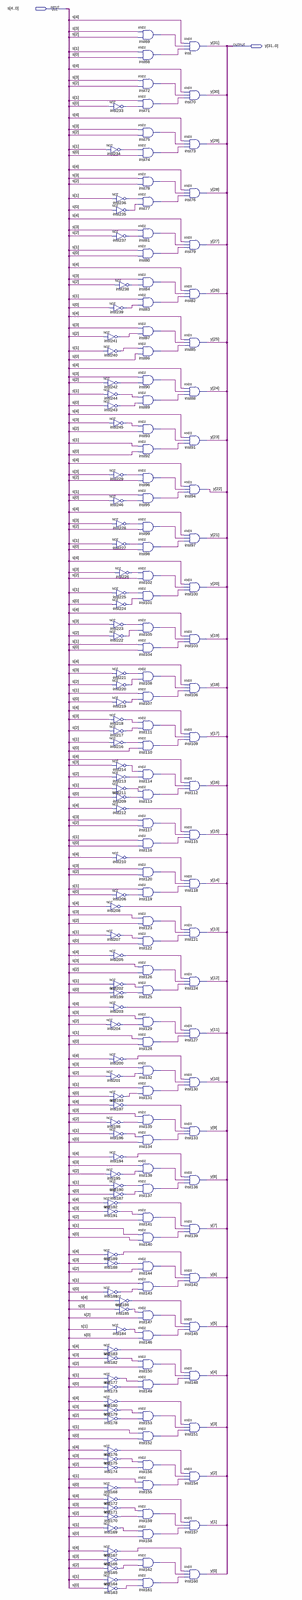
[diagram p0: schematic sheet, whole]
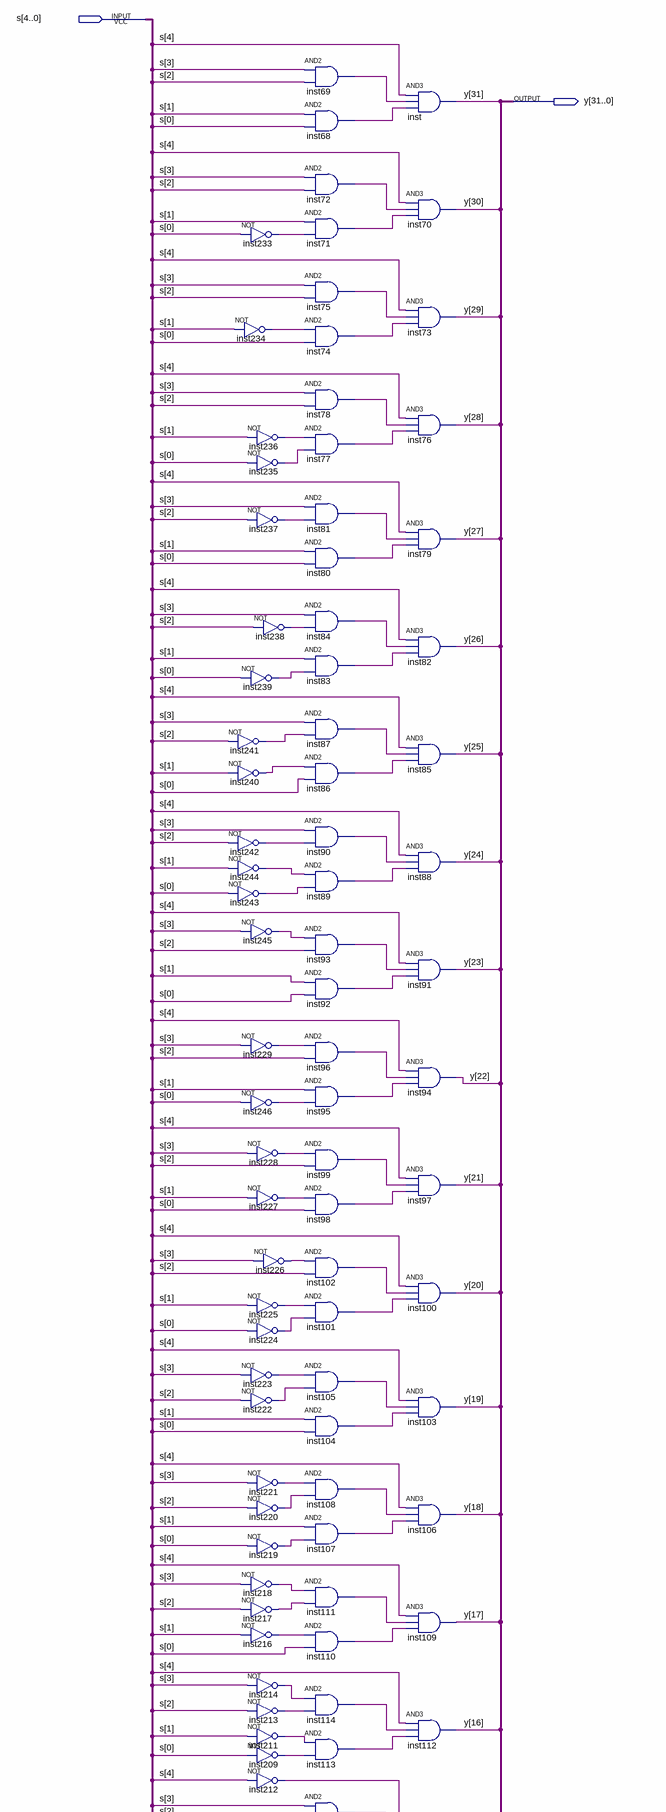
[diagram p1: schematic sheet, upper part]
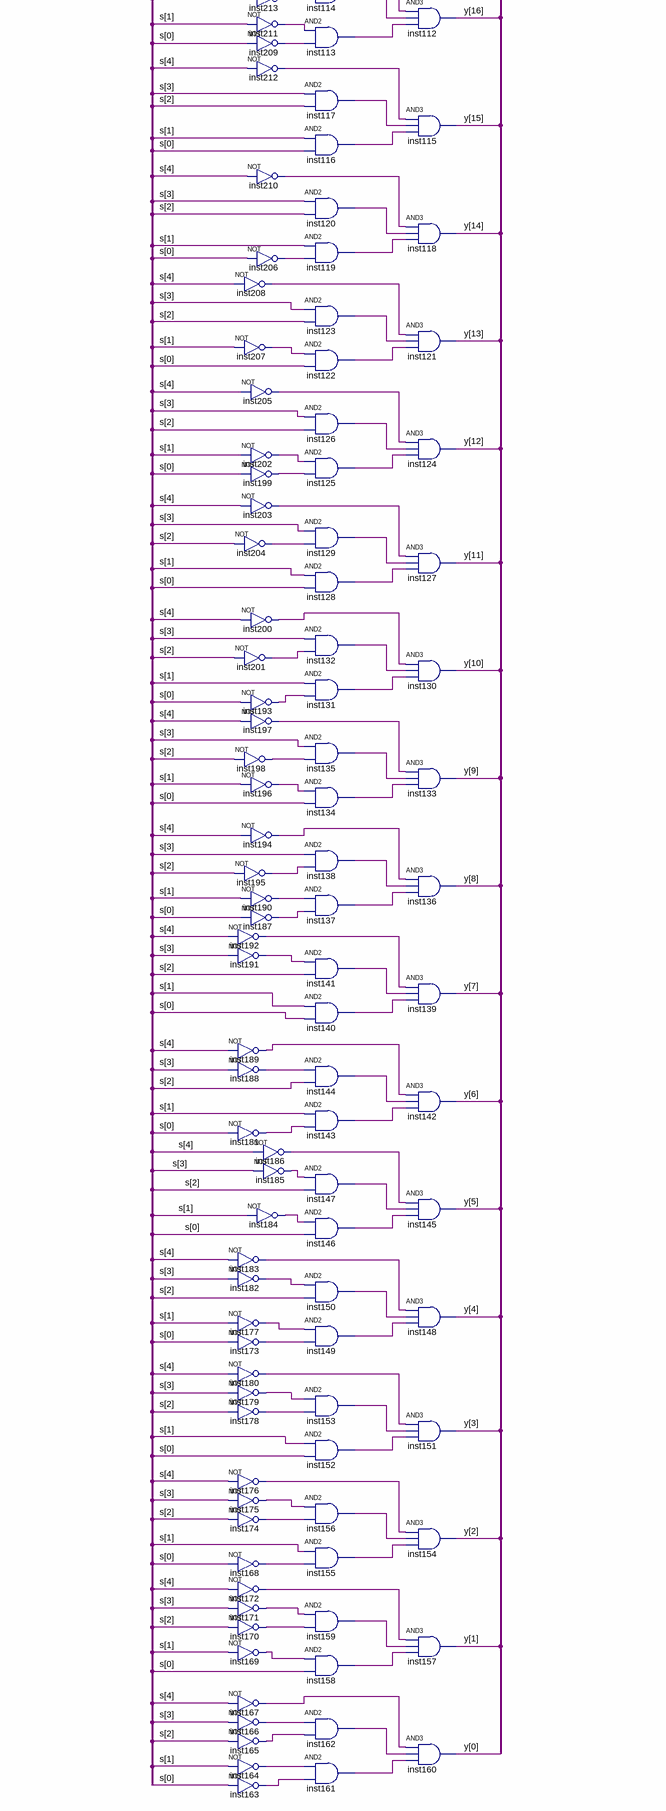
[diagram p2: schematic sheet, lower part]
// Quartus schematic seletor.bdf as structural Verilog: 176 symbols, 2 pins
module seletor (
  input  [4:0] s,
  output [31:0] y
);

  wire inst68_out, inst69_out, inst71_out, inst72_out, inst74_out, inst75_out, inst77_out, inst78_out,
       inst80_out, inst81_out, inst83_out, inst84_out, inst86_out, inst87_out, inst89_out, inst90_out,
       inst92_out, inst93_out, inst95_out, inst96_out, inst98_out, inst99_out, inst101_out, inst102_out,
       inst104_out, inst105_out, inst107_out, inst108_out, inst110_out, inst111_out, inst113_out,
       inst114_out, inst116_out, inst117_out, inst119_out, inst120_out, inst122_out, inst123_out,
       inst125_out, inst126_out, inst128_out, inst129_out, inst131_out, inst132_out, inst134_out,
       inst135_out, inst137_out, inst138_out, inst140_out, inst141_out, inst143_out, inst144_out,
       inst146_out, inst147_out, inst149_out, inst150_out, inst152_out, inst153_out, inst155_out,
       inst156_out, inst158_out, inst159_out, inst161_out, inst162_out, inst163_out, inst164_out,
       inst165_out, inst166_out, inst167_out, inst168_out, inst169_out, inst170_out, inst171_out,
       inst172_out, inst173_out, inst174_out, inst175_out, inst176_out, inst177_out, inst178_out,
       inst179_out, inst180_out, inst181_out, inst182_out, inst183_out, inst184_out, inst185_out,
       inst186_out, inst187_out, inst188_out, inst189_out, inst190_out, inst191_out, inst192_out,
       inst193_out, inst194_out, inst195_out, inst196_out, inst197_out, inst198_out, inst199_out,
       inst200_out, inst201_out, inst202_out, inst203_out, inst204_out, inst205_out, inst206_out,
       inst207_out, inst208_out, inst209_out, inst210_out, inst211_out, inst212_out, inst213_out,
       inst214_out, inst216_out, inst217_out, inst218_out, inst219_out, inst220_out, inst221_out,
       inst222_out, inst223_out, inst224_out, inst225_out, inst226_out, inst227_out, inst228_out,
       inst229_out, inst233_out, inst234_out, inst235_out, inst236_out, inst237_out, inst238_out,
       inst239_out, inst240_out, inst241_out, inst242_out, inst243_out, inst244_out, inst245_out, inst246_out;

  not inst233 (inst233_out, s[0]);
  not inst234 (inst234_out, s[1]);
  not inst239 (inst239_out, s[0]);
  not inst241 (inst241_out, s[2]);
  not inst240 (inst240_out, s[1]);
  not inst242 (inst242_out, s[2]);
  not inst244 (inst244_out, s[1]);
  not inst243 (inst243_out, s[0]);
  not inst245 (inst245_out, s[3]);
  not inst229 (inst229_out, s[3]);
  not inst246 (inst246_out, s[0]);
  not inst223 (inst223_out, s[3]);
  not inst222 (inst222_out, s[2]);
  not inst218 (inst218_out, s[3]);
  not inst217 (inst217_out, s[2]);
  not inst216 (inst216_out, s[1]);
  not inst208 (inst208_out, s[4]);
  not inst207 (inst207_out, s[1]);
  not inst205 (inst205_out, s[4]);
  not inst202 (inst202_out, s[1]);
  not inst199 (inst199_out, s[0]);
  not inst203 (inst203_out, s[4]);
  not inst204 (inst204_out, s[2]);
  not inst200 (inst200_out, s[4]);
  not inst201 (inst201_out, s[2]);
  not inst193 (inst193_out, s[0]);
  not inst197 (inst197_out, s[4]);
  not inst198 (inst198_out, s[2]);
  not inst196 (inst196_out, s[1]);
  not inst194 (inst194_out, s[4]);
  not inst195 (inst195_out, s[2]);
  not inst190 (inst190_out, s[1]);
  not inst187 (inst187_out, s[0]);
  not inst192 (inst192_out, s[4]);
  not inst191 (inst191_out, s[3]);
  not inst189 (inst189_out, s[4]);
  not inst188 (inst188_out, s[3]);
  not inst181 (inst181_out, s[0]);
  not inst183 (inst183_out, s[4]);
  not inst182 (inst182_out, s[3]);
  not inst177 (inst177_out, s[1]);
  not inst173 (inst173_out, s[0]);
  not inst180 (inst180_out, s[4]);
  not inst179 (inst179_out, s[3]);
  not inst178 (inst178_out, s[2]);
  not inst176 (inst176_out, s[4]);
  not inst175 (inst175_out, s[3]);
  not inst174 (inst174_out, s[2]);
  not inst168 (inst168_out, s[0]);
  not inst172 (inst172_out, s[4]);
  not inst171 (inst171_out, s[3]);
  not inst170 (inst170_out, s[2]);
  not inst169 (inst169_out, s[1]);
  not inst167 (inst167_out, s[4]);
  not inst166 (inst166_out, s[3]);
  not inst165 (inst165_out, s[2]);
  not inst164 (inst164_out, s[1]);
  not inst163 (inst163_out, s[0]);
  not inst236 (inst236_out, s[1]);
  not inst235 (inst235_out, s[0]);
  not inst237 (inst237_out, s[2]);
  not inst238 (inst238_out, s[2]);
  not inst228 (inst228_out, s[3]);
  not inst227 (inst227_out, s[1]);
  not inst226 (inst226_out, s[3]);
  not inst225 (inst225_out, s[1]);
  not inst224 (inst224_out, s[0]);
  not inst221 (inst221_out, s[3]);
  not inst220 (inst220_out, s[2]);
  not inst219 (inst219_out, s[0]);
  not inst214 (inst214_out, s[3]);
  not inst213 (inst213_out, s[2]);
  not inst211 (inst211_out, s[1]);
  not inst209 (inst209_out, s[0]);
  not inst212 (inst212_out, s[4]);
  not inst210 (inst210_out, s[4]);
  not inst206 (inst206_out, s[0]);
  not inst186 (inst186_out, s[4]);
  not inst185 (inst185_out, s[3]);
  not inst184 (inst184_out, s[1]);
  and inst69 (inst69_out, s[3], s[2]);
  and inst68 (inst68_out, s[1], s[0]);
  and inst72 (inst72_out, s[3], s[2]);
  and inst71 (inst71_out, s[1], inst233_out);
  and inst75 (inst75_out, s[3], s[2]);
  and inst74 (inst74_out, inst234_out, s[0]);
  and inst78 (inst78_out, s[3], s[2]);
  and inst77 (inst77_out, inst236_out, inst235_out);
  and inst81 (inst81_out, s[3], inst237_out);
  and inst80 (inst80_out, s[1], s[0]);
  and inst84 (inst84_out, s[3], inst238_out);
  and inst83 (inst83_out, s[1], inst239_out);
  and inst87 (inst87_out, s[3], inst241_out);
  and inst86 (inst86_out, inst240_out, s[0]);
  and inst90 (inst90_out, s[3], inst242_out);
  and inst89 (inst89_out, inst244_out, inst243_out);
  and inst93 (inst93_out, inst245_out, s[2]);
  and inst92 (inst92_out, s[1], s[0]);
  and inst96 (inst96_out, inst229_out, s[2]);
  and inst95 (inst95_out, s[1], inst246_out);
  and inst99 (inst99_out, inst228_out, s[2]);
  and inst98 (inst98_out, inst227_out, s[0]);
  and inst102 (inst102_out, inst226_out, s[2]);
  and inst101 (inst101_out, inst225_out, inst224_out);
  and inst105 (inst105_out, inst223_out, inst222_out);
  and inst104 (inst104_out, s[1], s[0]);
  and inst108 (inst108_out, inst221_out, inst220_out);
  and inst107 (inst107_out, s[1], inst219_out);
  and inst111 (inst111_out, inst218_out, inst217_out);
  and inst110 (inst110_out, inst216_out, s[0]);
  and inst114 (inst114_out, inst214_out, inst213_out);
  and inst113 (inst113_out, inst211_out, inst209_out);
  and inst117 (inst117_out, s[3], s[2]);
  and inst116 (inst116_out, s[1], s[0]);
  and inst120 (inst120_out, s[3], s[2]);
  and inst119 (inst119_out, s[1], inst206_out);
  and inst123 (inst123_out, s[3], s[2]);
  and inst122 (inst122_out, inst207_out, s[0]);
  and inst126 (inst126_out, s[3], s[2]);
  and inst125 (inst125_out, inst202_out, inst199_out);
  and inst129 (inst129_out, s[3], inst204_out);
  and inst128 (inst128_out, s[1], s[0]);
  and inst132 (inst132_out, s[3], inst201_out);
  and inst131 (inst131_out, s[1], inst193_out);
  and inst135 (inst135_out, s[3], inst198_out);
  and inst134 (inst134_out, inst196_out, s[0]);
  and inst138 (inst138_out, s[3], inst195_out);
  and inst137 (inst137_out, inst190_out, inst187_out);
  and inst141 (inst141_out, inst191_out, s[2]);
  and inst140 (inst140_out, s[1], s[0]);
  and inst144 (inst144_out, inst188_out, s[2]);
  and inst143 (inst143_out, s[1], inst181_out);
  and inst147 (inst147_out, inst185_out, s[2]);
  and inst146 (inst146_out, inst184_out, s[0]);
  and inst150 (inst150_out, inst182_out, s[2]);
  and inst149 (inst149_out, inst177_out, inst173_out);
  and inst153 (inst153_out, inst179_out, inst178_out);
  and inst152 (inst152_out, s[1], s[0]);
  and inst156 (inst156_out, inst175_out, inst174_out);
  and inst155 (inst155_out, s[1], inst168_out);
  and inst159 (inst159_out, inst171_out, inst170_out);
  and inst158 (inst158_out, inst169_out, s[0]);
  and inst162 (inst162_out, inst166_out, inst165_out);
  and inst161 (inst161_out, inst164_out, inst163_out);
  and inst (y[31], s[4], inst69_out, inst68_out);
  and inst70 (y[30], s[4], inst72_out, inst71_out);
  and inst73 (y[29], s[4], inst75_out, inst74_out);
  and inst76 (y[28], s[4], inst78_out, inst77_out);
  and inst79 (y[27], s[4], inst81_out, inst80_out);
  and inst82 (y[26], s[4], inst84_out, inst83_out);
  and inst85 (y[25], s[4], inst87_out, inst86_out);
  and inst88 (y[24], s[4], inst90_out, inst89_out);
  and inst91 (y[23], s[4], inst93_out, inst92_out);
  and inst94 (y[22], s[4], inst96_out, inst95_out);
  and inst97 (y[21], s[4], inst99_out, inst98_out);
  and inst100 (y[20], s[4], inst102_out, inst101_out);
  and inst103 (y[19], s[4], inst105_out, inst104_out);
  and inst106 (y[18], s[4], inst108_out, inst107_out);
  and inst109 (y[17], s[4], inst111_out, inst110_out);
  and inst112 (y[16], s[4], inst114_out, inst113_out);
  and inst115 (y[15], inst212_out, inst117_out, inst116_out);
  and inst118 (y[14], inst210_out, inst120_out, inst119_out);
  and inst121 (y[13], inst208_out, inst123_out, inst122_out);
  and inst124 (y[12], inst205_out, inst126_out, inst125_out);
  and inst127 (y[11], inst203_out, inst129_out, inst128_out);
  and inst130 (y[10], inst200_out, inst132_out, inst131_out);
  and inst133 (y[9], inst197_out, inst135_out, inst134_out);
  and inst136 (y[8], inst194_out, inst138_out, inst137_out);
  and inst139 (y[7], inst192_out, inst141_out, inst140_out);
  and inst142 (y[6], inst189_out, inst144_out, inst143_out);
  and inst145 (y[5], inst186_out, inst147_out, inst146_out);
  and inst148 (y[4], inst183_out, inst150_out, inst149_out);
  and inst151 (y[3], inst180_out, inst153_out, inst152_out);
  and inst154 (y[2], inst176_out, inst156_out, inst155_out);
  and inst157 (y[1], inst172_out, inst159_out, inst158_out);
  and inst160 (y[0], inst167_out, inst162_out, inst161_out);
endmodule
